# EAGLE design IQOV-164_Evo_board (EAGLE 9.7.0)
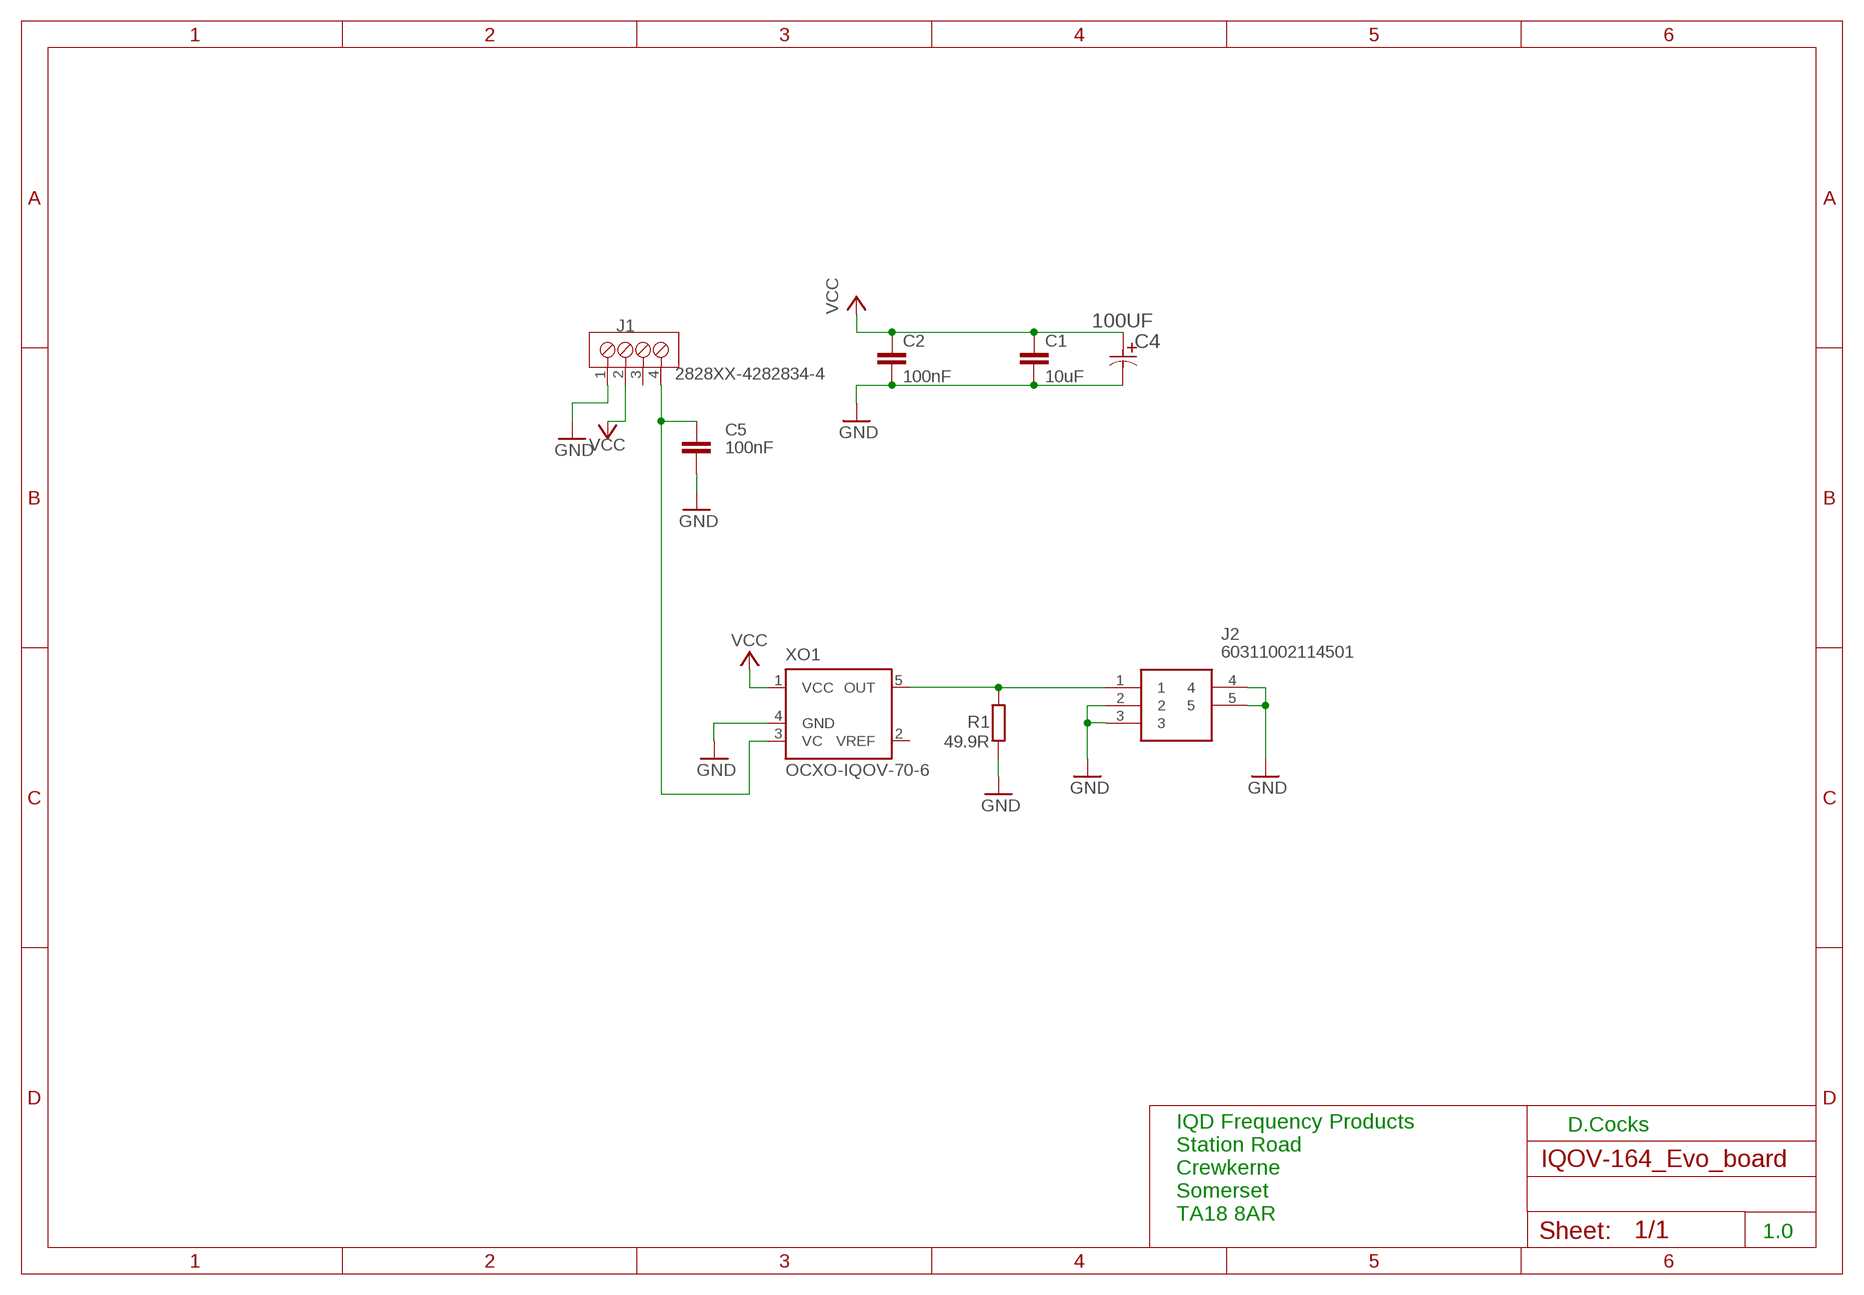
[diagram p0: schematic, sheet 1]

## Parts
C1  10uF  C-EUC0805  [C0805]
C2  100nF  C-EUC0805  [C0805]
C4  100UF  EEE-FK0J101UR-CASE-C  [CAPAE530X610N]
C5  100nF  C-EUC0805  [C0805]
J1  2828XX-4282834-4  [TERMBLK_254-4N]
J2  60311002114501  60312002114503  [60312002114503]
R1  49.9R  R-EU_M1206  [M1206]
XO1  OCXO-IQOV-70-6  [C0-08-8]

## Nets
GND: C1.2 C2.2 C4.2 C5.2 J1.1 J2.2 J2.3 J2.4 J2.5 R1.1 XO1.4(GND)
N$2: J2.1 R1.2 XO1.5(OUT)
N$6: C5.1 J1.4 XO1.3(VC)
VCC: C1.1 C2.1 C4.1 J1.2 XO1.1(VCC)
Unconnected: J1.3 XO1.2(VREF)

## Notes on the sheet
- D.Cocks
- IQD Frequency Products
  Station Road
  Crewkerne
  Somerset
  TA18 8AR
- 1.0

## Library data of the parts
C1 C2 C5 = resistor:C-EU: CAPACITOR, European symbol
C4 = Panasonic-EEEFK_EEEFP:EEE-: Aluminum Electrolytic Capacitors,Surface Mount Type; MPN: EEE-FK0J101UR; OC_FARNELL: 1850085; OC_NEWARK: 23T0829; PACKAGE: CASE-C; SUPPLIER: PANASONIC; TOLERANCE: ±20 %; VOLTAGERATING: 6.3V
J1 = Connector:2828XX-4: 4 Position Wire to Board Terminal Block Horizontal with Board Reference: Datasheet <https://www.te.com.cn/commerce/DocumentDelivery/DDEController?Action=showdoc&DocId=Catalog+Section%7F1308389_EUROSTYLE_TERMINAL_BLOCKS%7F0607%7Fpdf%7FEnglish%7FENG_CS_1308389_EUROSTYLE_TERMINAL_BLOCKS_0607.pdf%7F2-282837-5>; CATEGORY: Connectors; DATASHEET: https://www.te.com/usa-en/product-282834-4.datasheet.pdf; DESCRIPTION: 4 Position Wire to Board Terminal Block Horizontal with Board 0.100" (2.54mm) Through Hole; MANUFACTURER: TE Connectivity AMP Connectors; MPN: 282834-4; OPERATING_TEMPERATURE: -40°C ~ 105°C; PACKAGE_SIZE: NA; PACKAGE_TYPE: Through Hole; PART_STATUS: Active; PITCH: 0.100" (2.54mm); ROHS: Compliant; SERIES: Buchanan; SUBCATEGORY: Terminal Blocks; TYPE: Screw Terminal - Rising Cage Clamp Side Wire Entry
J2 = 60312002114503:60312002114503: Wurth Elektronik, WR-SMA Straight PCB Mount Coaxial Connector, jack, Gold over Nickel, Solder Termination Source: Datasheet <https://katalog.we-online.de/em/datasheet/60312002114503.pdf>; DESCRIPTION: Wurth Elektronik, WR-SMA Straight PCB Mount Coaxial Connector, jack, Gold over Nickel, Solder Termination; HEIGHT: 9.56mm; MANUFACTURER_NAME: Wurth Elektronik; MANUFACTURER_PART_NUMBER: 60312002114503; MOUSER_PART_NUMBER: 710-60312002114503; MOUSER_PRICE-STOCK: https://www.mouser.co.uk/ProductDetail/Wurth-Elektronik/60312002114503?qs=3jNSNtuqJTL%2FGpZA1FAOxw%3D%3D
R1 = resistor:R-EU_: RESISTOR, European symbol
XO1 = IQD-Frequency-Products:OCXO: Oven controlled Xtal Oscillator

## Board
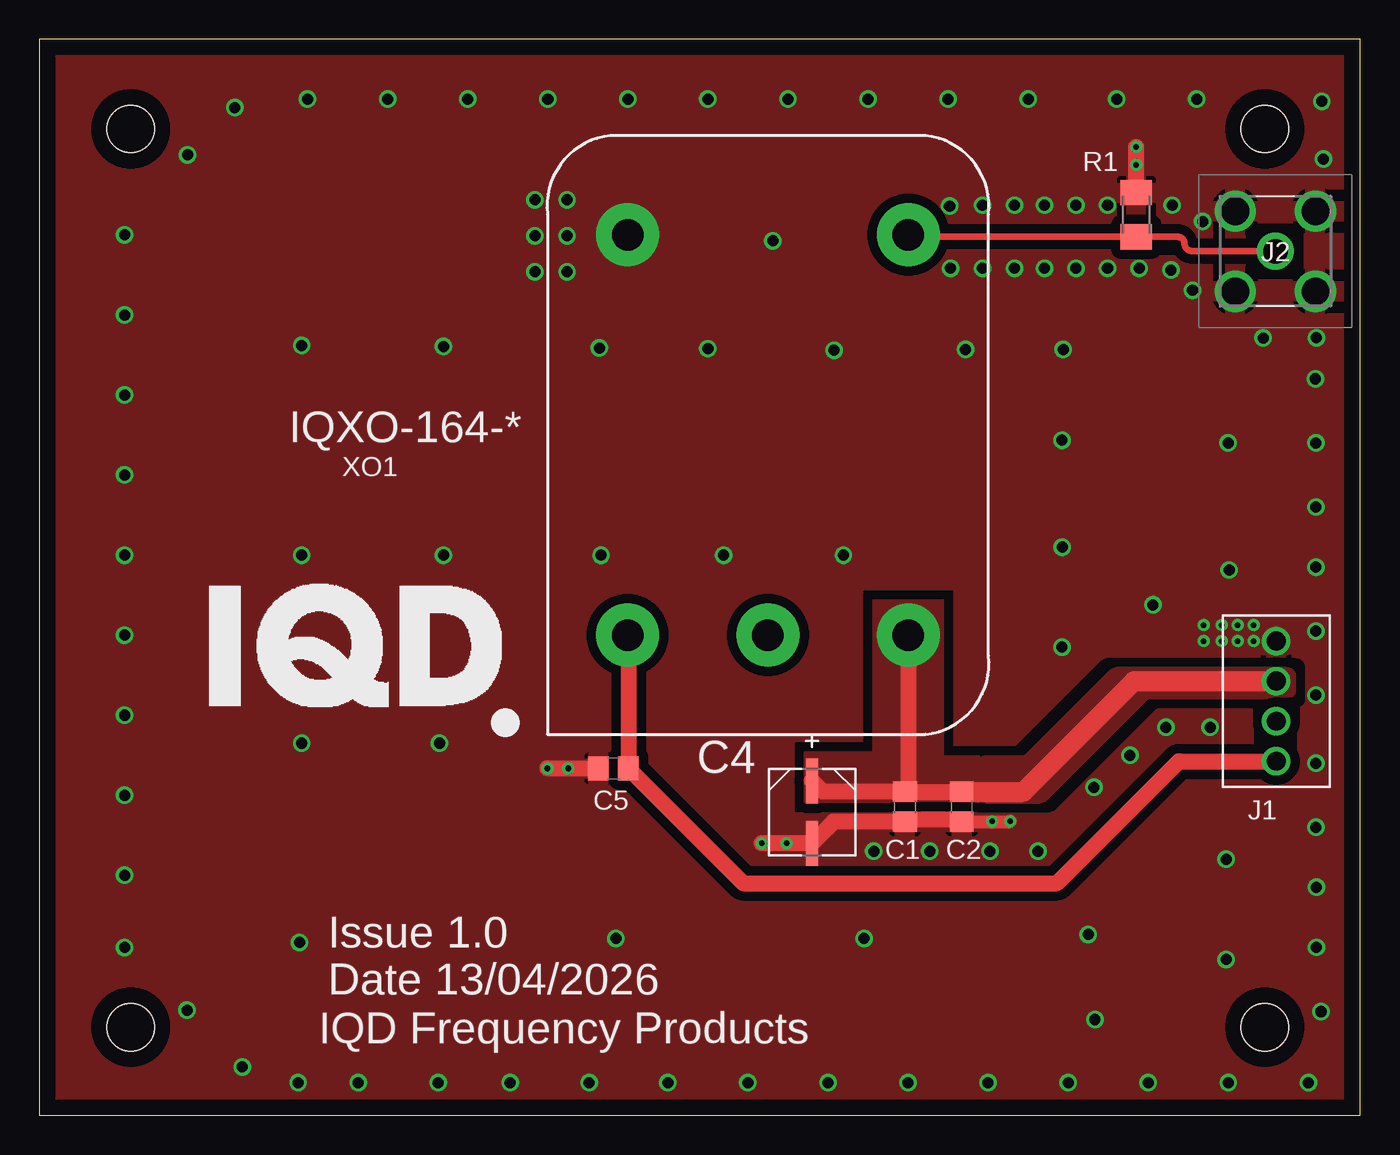
[diagram p1: board, top side]
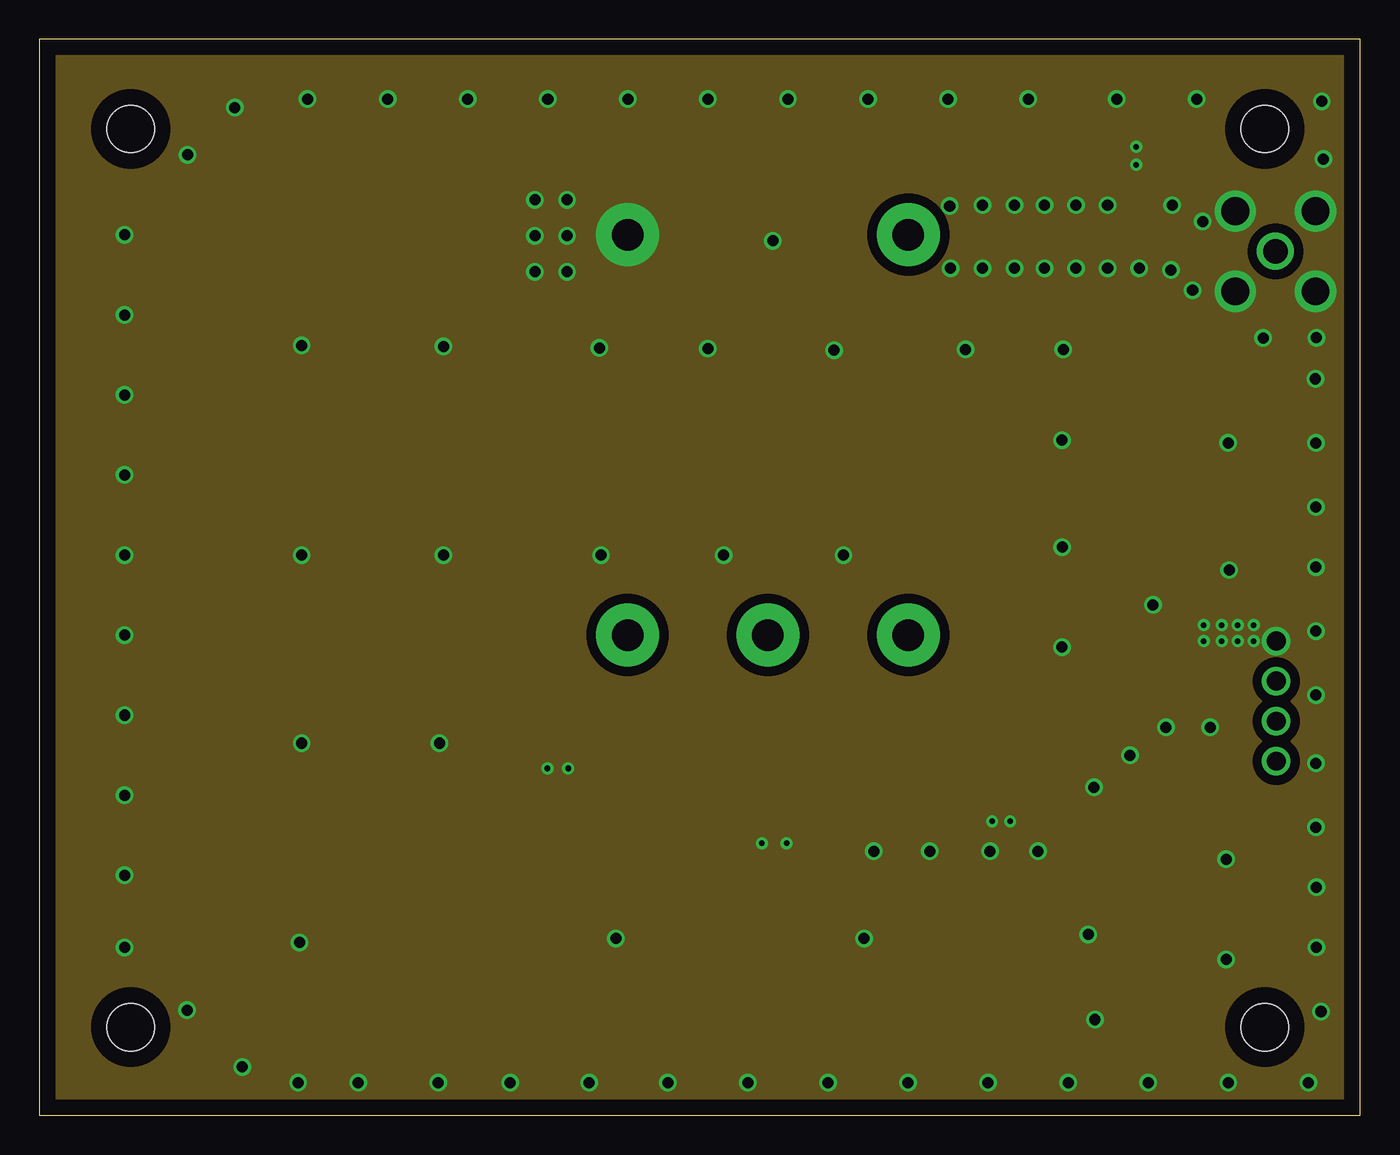
[diagram p2: board, inner layer Route2]
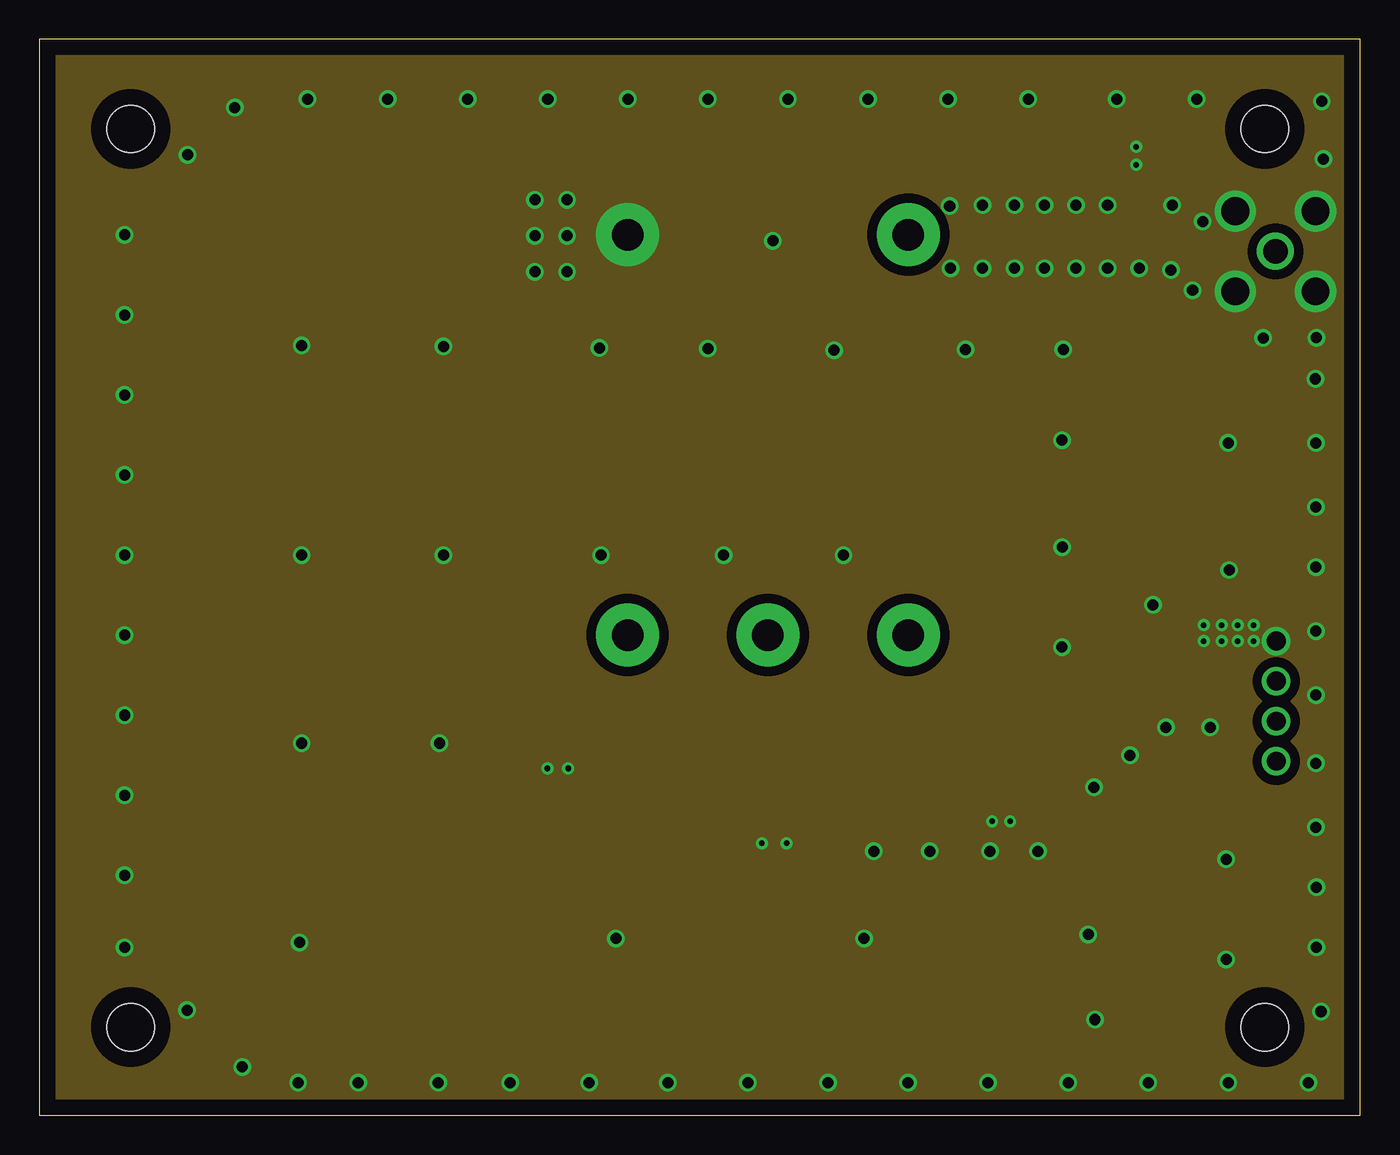
[diagram p3: board, inner layer Route15]
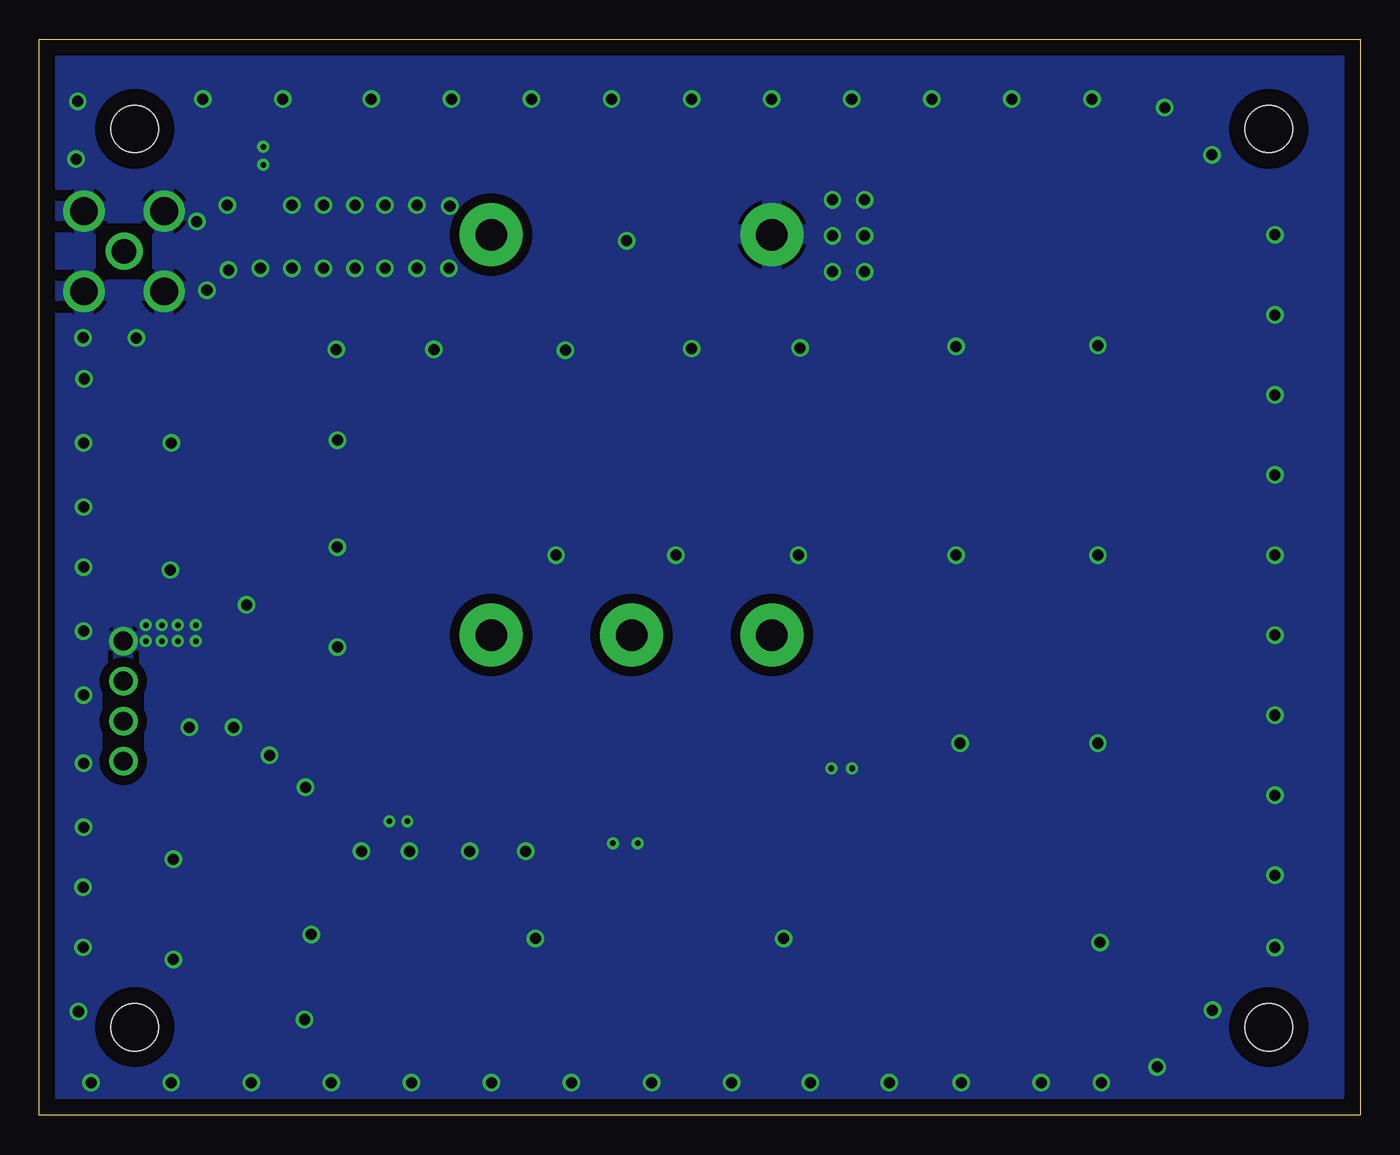
[diagram p4: board, bottom side, seen from below]

Size 83.8 x 68.28 mm. Coordinates in mm from the lower left corner, seen from the top.
Outline: 0,0 83.8,0 83.8,68.28 0,68.28 0,0
Copper layers (1+2*15+16): Top 0.035mm / dielectric 1.5mm / Route2 0.035mm / dielectric 0.15mm / Route15 0.035mm / dielectric 0.2mm / Bottom 0.035mm
Design rules "Fusion Electronics Design Rules *": minimum track width 6mil, minimum drill 0.35mm, track to track 0.6mm, track to pad 0.6mm, pad to pad 6mil, via to via 6mil, smd to smd 6mil, copper to edge 40mil, drill to drill 6mil, minimum pad ring 10mil, minimum via ring 8mil, stop-mask expansion 4mil, vias tented up to drill 0mil, thermal gap 10mil
Holes 3 mm at 5.79,62.6 5.79,5.6 77.75,5.6 77.75,62.6

### Footprints (pad centres in the part's own frame; a part is rotated, then mirrored left to right if it is on the bottom)
C0805 = smd 1.3 x 1.5: 1 -0.95,0; 2 0.95,0
CAPAE530X610N = smd 2.87 x 0.762: 1 -1.981,0; 2 1.981,0
TERMBLK_254-4N = drill 1.2: 1 0,0; 2 2.54,0; 3 5.08,0; 4 7.62,0
60312002114503 = drill 1.55 pad 2.325: 1 0,0 | drill 1.75 pad 2.625: 2 -2.54,-2.54; 3 -2.54,2.54; 4 2.54,-2.54; 5 2.54,2.54
M1206 = smd 1.6 x 2: 1 -1.4,0; 2 1.4,0
C0-08-8 = drill 2 pad 4: 1 -12.7,-8.9; 2 -12.7,0; 3 -12.7,8.9; 4 12.7,8.9; 5 12.7,-8.9

### Placement (x,y rotation side)
C1  54.91,19.58 270 top
C2  58.52,19.58 270 top
C4  49.02,19.25 270 top
C5  36.42,22.02 180 top
J1  78.48,30.1 270 top
J2  78.42,54.84 0 top
R1  69.6,57.15 270 top
XO1  46.23,43.18 90 top

### Tracks (layer width: path | path; a pad name or v marks a point on that pad's centre or on a via)
GND  (via drill 0.35, 0.7)
  Top 0.813: 58.33,18.82 C2.2 61.56,18.63 v61.59,18.67
  Top 1.016: 58.33,18.77 55.06,18.77 C1.2 50.38,18.63 C4.2 v45.85,17.27 | R1.1 v69.6,61.47 | v32.23,22.02 C5.2
  other vias: 9.4,60.96 5.4,55.88 5.4,50.8 5.4,45.72 5.4,40.64 5.4,35.56 5.4,30.48 5.4,25.4 5.4,20.32 5.4,15.24 5.4,10.66 9.36,6.68 39.88,2.08 44.96,2.08 50.04,2.08 55.12,2.08 60.2,2.08 65.28,2.08 70.36,2.08 75.44,2.08 80.52,2.08 81.03,10.67 81.03,14.48 80.99,18.29 80.99,22.35 80.99,26.67 80.99,30.73 80.99,34.8 80.99,38.61 80.99,42.67 73.44,64.5 68.36,64.5 62.74,64.5 57.66,64.5 52.58,64.5 47.5,64.5 42.42,64.5 37.34,64.5 25.64,48.8 58.76,48.6 43.42,35.56 25.64,35.56 42.42,48.66 63.78,53.76 65.78,53.76 67.78,53.76 69.78,53.76 63.78,57.76 65.78,57.76 67.78,57.76 32.26,64.5 27.18,64.5 22.1,64.5 17.02,64.5 81.37,64.35 34.88,2.08 29.88,2.08 12.88,3.08 12.4,63.95 16.64,35.56 16.64,48.86 35.54,48.7 50.42,48.56 46.54,55.5 64.9,36.07 35.64,35.56 51.02,35.56 64.96,48.6 70.66,32.4 64.88,42.85 64.88,29.72 66.98,6.08 81.32,6.59 73.17,52.37 81.02,49.35 71.88,57.76 80.96,46.74 81.47,60.69 75.3,16.25 75.3,9.9 66.92,20.83 77.66,49.33 75.43,42.67 75.5,34.61 73.88,30.1 73.81,56.73 71.8,53.65 69.6,60.32 75.02,30.1 60.45,18.67 61.87,57.76 61.87,53.76 33.48,58.11 33.48,55.82 33.48,53.54 31.45,58.11 31.45,55.82 31.45,53.54 59.84,57.76 59.84,53.76 57.81,53.76 57.76,57.71 33.55,22.02 16.64,23.62 25.38,23.62 25.31,2.08 20.23,2.08 16.42,2.08 16.51,10.97 36.58,11.22 52.32,11.22 66.55,11.48 76.04,30.1 77.05,30.1 73.88,31.12 75.02,31.12 76.04,31.12 77.05,31.12 52.95,16.76 56.5,16.76 60.31,16.76 63.36,16.76 69.2,22.86 71.49,24.64 74.28,24.64 47.41,17.27
  pour Bottom (rank 2): -1.52,-3.1 95.89,-3.1 95.89,1.46 95.85,1.57 95.83,1.65 95.82,1.69 95.82,67.26 95.82,67.26 95.82,67.32 95.82,67.38 95.82,67.39 95.87,71.63 -1.32,71.63
  pour Top (rank 2): -4.82,-8.34 101.7,-8.39 101.63,-4.93 101.63,-4.92 101.63,-4.87 101.62,-4.81 101.63,-4.8 101.63,75.18 -6.18,75.18
  pour Route2 (no thermals): -9.58,-12.62 107.11,-12.62 107.11,77.39 -9.58,77.39
  pour Route15 (no thermals): -12.12,-15.16 108.38,-15.16 108.38,79.93 -12.12,79.93
  pour Top (no thermals): 30.3,52.65 39.55,52.65 39.55,58.85 30.3,58.85
  pour Top (no thermals): 73.79,29.84 79.12,29.84 79.12,31.37 73.79,31.37
N$2
  Top 0.406: 69.39,55.96 R1.2 | R1.2 72.27,55.75 arc-90 72.64,55.37 arc90 73.17,54.84 J2.1 | R1.2 55.26,55.75 XO1.5
N$6
  Top 1.016: J1.4 72.31,22.48 64.55,14.73 44.67,14.73 C5.1 37.37,30.43 XO1.3
VCC
  Top 1.016: 49.01,21.25 C4.1 49.72,20.53 C1.1 | C1.1 C2.1 | XO1.1 55.13,20.75 C1.1
  Top 1.27: C2.1 62.44,20.53 69.47,27.56 J1.2
  pour Top (no thermals): 52.9,23.07 52.88,23.05 52.85,23.04 48.59,23.04 48.59,19.89 59.61,19.89 59.61,22.78 57.39,22.78 57.36,22.8 57.34,22.82 57.33,22.84 57.33,32.69 52.91,32.69 52.91,23.1
  pour Top (no thermals): 62.78,22.3 62.67,22.25 62.55,22.23 60.07,22.23 60.07,20.45 63.49,20.45 69.95,26.91 70.06,26.98 70.17,27.03 70.3,27.05 79.12,27.05 79.12,27.81 68.34,27.81 62.89,22.37

### Text on the board
tPlace: IQXO-164-* | Issue 1.0 / Date 13/04/2026 | IQD Frequency Products